# EAGLE design Breadboard-NRF24L01 (EAGLE 7.5.0)
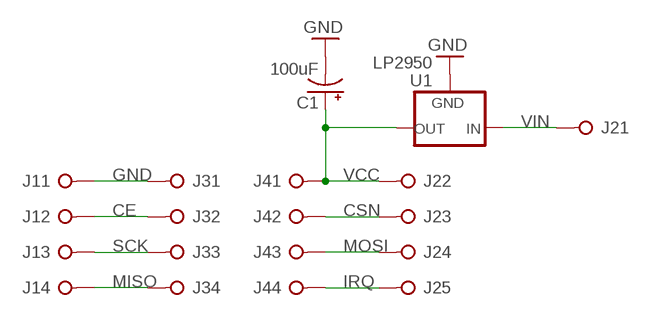
[diagram p0: schematic, sheet 1]

## Parts
C1  100uF  CAP-POL-2.5-6  [CAP-POL-2.5-6]
J1  PINHD-1X4  [1X04]
J2  PINHD-1X5  [1X05]
J3  PINHD-1X4  [1X04]
J4  PINHD-1X4  [1X04]
U1  LP2950  [TO92-INLINE]

## Nets
CE: J1.2 J3.2
CSN: J2.3 J4.2
GND: C1.- J1.1 J3.1 U1.2(GND)
IRQ: J2.5 J4.4
MISO: J1.4 J3.4
MOSI: J2.4 J4.3
SCK: J1.3 J3.3
VCC: C1.+ J2.2 J4.1 U1.1(OUT)
VIN: J2.1 U1.3(IN)

## Library data of the parts
C1 = SaintGimp:CAP-POL-*: Polarized Capacitor
J1 J3 J4 = SaintGimp:PINHD-1X4
J2 = SaintGimp:PINHD-1X5
U1 = SaintGimp:LP2950: Volate Regulator

## Board
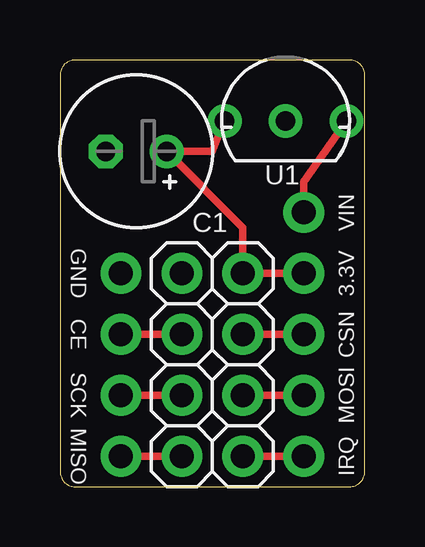
[diagram p1: board, top side]
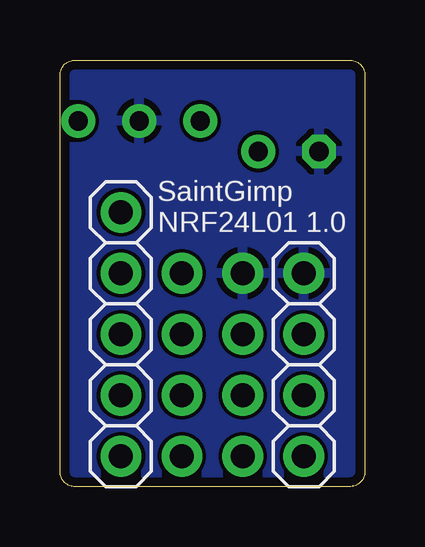
[diagram p2: board, bottom side, seen from below]

Size 12.7 x 17.78 mm. Coordinates in mm from the lower left corner, seen from the top.
Outline: 0,17.14 0,0.64 arc90 0.64,0 12.06,0 arc90 12.7,0.64 12.7,17.14 arc90 12.06,17.78 0.64,17.78 arc90 0,17.14
Copper layers (1*16): Top 0.0356mm / dielectric 1.5011mm / Bottom 0.0356mm
Design rules "Saintgimp-OSHPark *": minimum track width 10mil, minimum drill 13mil, track to track 6mil, track to pad 6mil, pad to pad 6mil, via to via 6mil, smd to smd 6mil, copper to edge 15mil, drill to drill 6mil, minimum pad ring 12mil, minimum via ring 7mil, stop-mask expansion 2mil, vias tented up to drill 24mil, thermal gap 10mil

### Footprints (pad centres in the part's own frame; a part is rotated, then mirrored left to right if it is on the bottom)
CAP-POL-2.5-6 = drill 0.8: + -1.27,0 | drill 0.8 octagon: - 1.27,0
1X04 = drill 1: 1 -3.81,0; 2 -1.27,0; 3 1.27,0; 4 3.81,0
1X05 = drill 1: 1 -5.08,0; 2 -2.54,0; 3 0,0; 4 2.54,0; 5 5.08,0
TO92-INLINE = drill 0.8: 1 -2.54,0; 2 0,0; 3 2.54,0

### Placement (x,y rotation side)
C1  3.17,13.97 180 top
J1  2.54,5.08 270 bottom
J2  10.16,6.35 270 bottom
J3  5.08,5.08 270 top
J4  7.62,5.08 270 top
U1  9.4,15.24 0 top

### Tracks (layer width: path | path; a pad name or v marks a point on that pad's centre or on a via)
CE
  Top 0.305: J3.2 J1.2
CSN
  Top 0.305: J4.2 J2.3
GND
  pour Bottom: 0,17.78 12.7,17.78 12.7,0 0,0
IRQ
  Top 0.305: J4.4 J2.5
MISO
  Top 0.305: J3.4 J1.4
MOSI
  Top 0.305: J2.4 J4.3
SCK
  Top 0.305: J1.3 J3.3
VCC
  Top 0.305: U1.1 6.35,13.97 C1.+ 7.62,10.79 J4.1 J2.2
VIN
  Top 0.305: J2.1 10.16,12.7 U1.3

### Text on the board
_tsilk: VIN | GND | 3.3V | CE | CSN | SCK | MOSI | MISO | IRQ
_bsilk: SaintGimp / NRF24L01 1.0